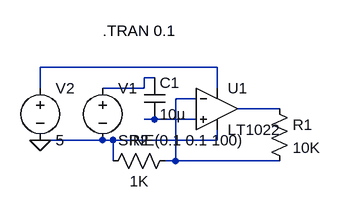
[diagram p0: schematic Draft55.asc]
Draft55.asc, the LTspice schematic file:
Version 4
SHEET 1 880 680
WIRE 416 240 144 240
WIRE 320 256 304 256
WIRE 144 272 144 240
WIRE 304 272 304 256
WIRE 304 272 240 272
WIRE 416 272 416 240
WIRE 384 288 352 288
WIRE 512 304 448 304
WIRE 320 320 304 320
WIRE 384 320 320 320
WIRE 240 352 144 352
WIRE 256 352 240 352
WIRE 416 352 416 336
WIRE 416 352 256 352
WIRE 256 384 256 352
WIRE 352 384 352 288
WIRE 352 384 336 384
WIRE 512 384 352 384
FLAG 144 352 0
SYMBOL voltage 240 256 R0
SYMATTR InstName V1
SYMATTR Value SINE(0.1 0.1 100)
SYMBOL Opamps/LT1022 416 240 R0
SYMATTR InstName U1
SYMBOL voltage 144 256 R0
SYMATTR InstName V2
SYMATTR Value 5
SYMBOL res 496 288 R0
SYMATTR InstName R1
SYMATTR Value 10K
SYMBOL res 352 368 R90
WINDOW 0 0 56 VBottom 2
WINDOW 3 32 56 VTop 2
SYMATTR InstName R2
SYMATTR Value 1K
SYMBOL cap 304 256 R0
SYMATTR InstName C1
SYMATTR Value 10µ
TEXT 240 184 Left 2 !.TRAN 0.1

The netlist it stands for:
* Draft55.asc
V1 N002 0 SINE(0.1 0.1 100)
XU1 N005 N003 N001 0 N004 LT1022  ; pins In+ In- V+ V- OUT
V2 N001 0 5
R1 N004 N003 10K
R2 N003 0 1K
C1 N002 N005 10µ
.TRAN 0.1
.backanno
.end